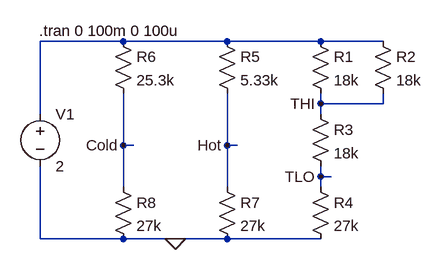
[diagram p0: schematic Temp_Sensor.asc]
Temp_Sensor.asc, the LTspice schematic file:
Version 4
SHEET 1 880 680
WIRE -128 48 -256 48
WIRE 32 48 -128 48
WIRE 176 48 32 48
WIRE 272 48 176 48
WIRE 176 144 176 128
WIRE 272 144 272 128
WIRE 272 144 176 144
WIRE -256 160 -256 48
WIRE 176 160 176 144
WIRE -128 208 -128 128
WIRE -112 208 -128 208
WIRE 32 208 32 128
WIRE 48 208 32 208
WIRE 176 256 176 240
WIRE 192 256 176 256
WIRE -128 272 -128 208
WIRE 32 272 32 208
WIRE 176 272 176 256
WIRE -256 352 -256 240
WIRE -128 352 -256 352
WIRE -48 352 -128 352
WIRE 32 352 -48 352
WIRE 176 352 32 352
FLAG -48 352 0
FLAG -128 208 Cold
FLAG 32 208 Hot
FLAG 176 256 TLO
FLAG 176 144 THI
SYMBOL res 160 32 R0
SYMATTR InstName R1
SYMATTR Value 18k
SYMBOL res 256 32 R0
SYMATTR InstName R2
SYMATTR Value 18k
SYMBOL res 160 144 R0
SYMATTR InstName R3
SYMATTR Value 18k
SYMBOL res 160 256 R0
SYMATTR InstName R4
SYMATTR Value 27k
SYMBOL res 16 32 R0
SYMATTR InstName R5
SYMATTR Value 5.33k
SYMBOL res -144 32 R0
SYMATTR InstName R6
SYMATTR Value 25.3k
SYMBOL res 16 256 R0
SYMATTR InstName R7
SYMATTR Value 27k
SYMBOL res -144 256 R0
SYMATTR InstName R8
SYMATTR Value 27k
SYMBOL voltage -256 144 R0
SYMATTR InstName V1
SYMATTR Value 2
TEXT -258 32 Left 2 !.tran 0 100m 0 100u

The netlist it stands for:
* Temp_Sensor.asc
R1 N001 THI 18k
R2 N001 THI 18k
R3 THI TLO 18k
R4 TLO 0 27k
R5 N001 Hot 5.33k
R6 N001 Cold 25.3k
R7 Hot 0 27k
R8 Cold 0 27k
V1 N001 0 2
.tran 0 100m 0 100u
.backanno
.end